# Altium schematic sheet Connectors1.SchDoc: Connectors
size Letter; DrawnBy: Kyle Hong, Noah Chapman; Organization: UW Robotics; Address1: 200 University Avenue; Address2: Waterloo; Address3: Ontario; Address4: Canada N2L 3G6
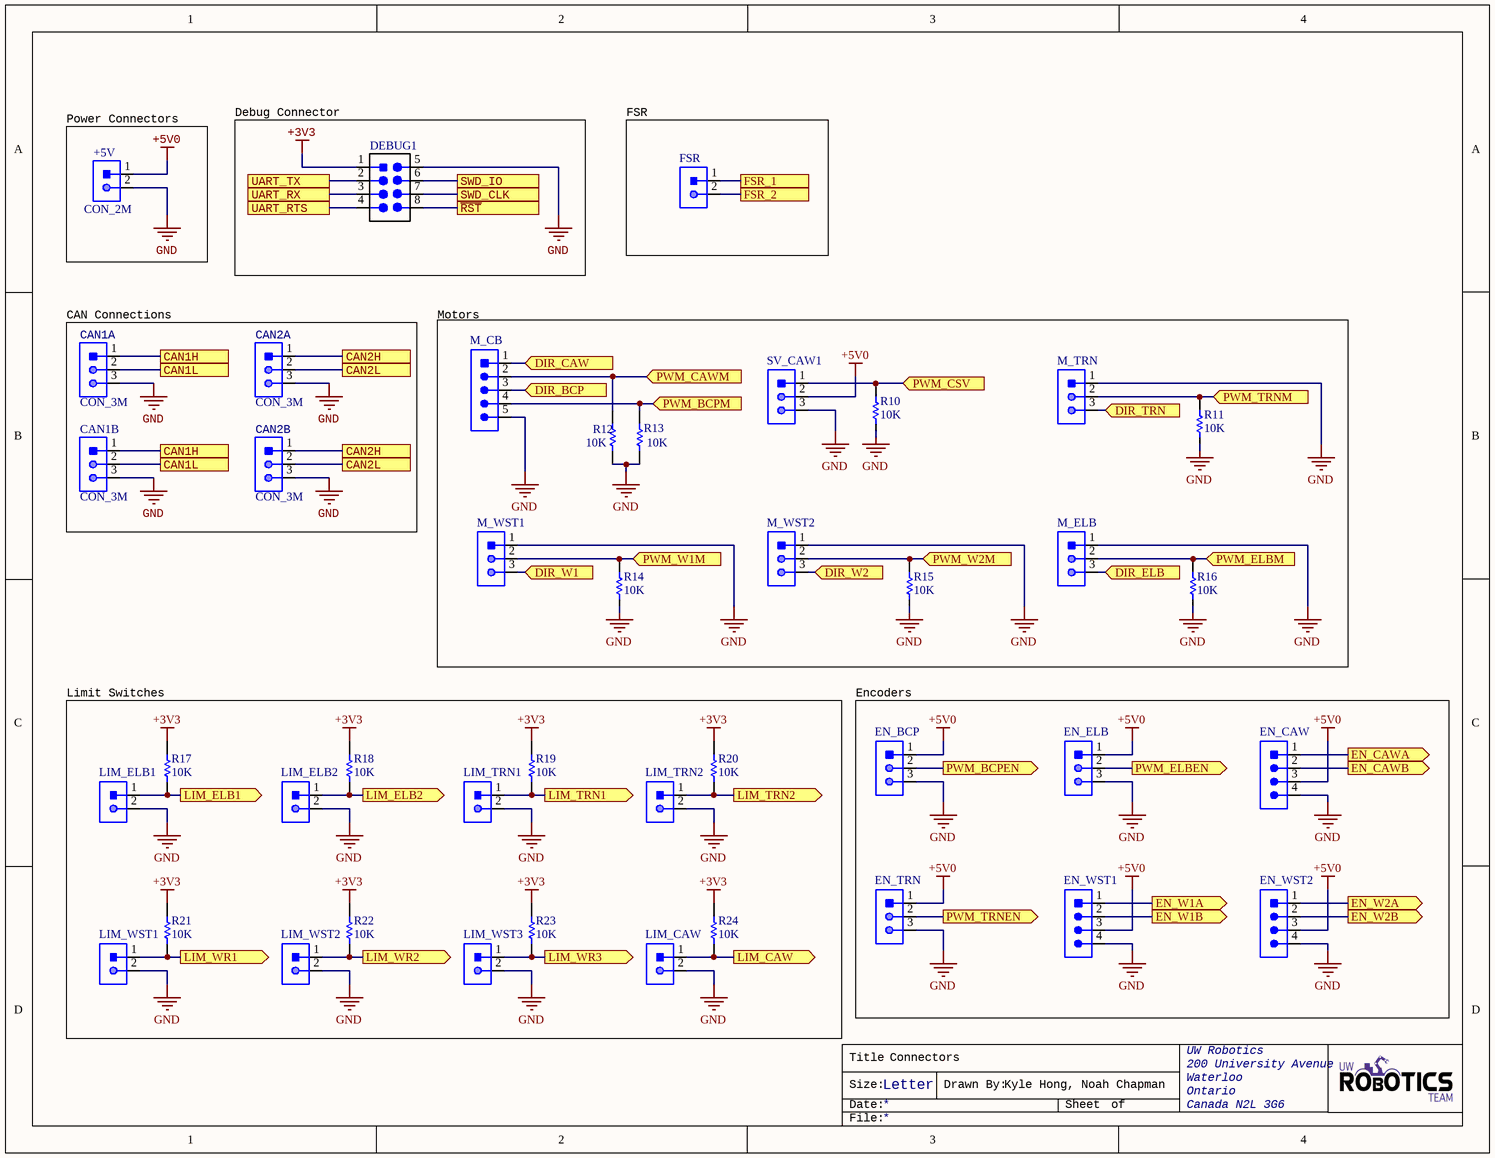
[diagram p0: Connectors1.SchDoc]

## Parts
+5V  CON_2M  [JST-B2B-PHSK]
CAN1A  CON_3M  [JST-B3B-SM4-TB]
CAN1B  CON_3M  [JST-B3B-SM4-TB]
CAN2A  CON_3M  [JST-B3B-SM4-TB]
CAN2B  CON_3M  [JST-B3B-SM4-TB]
DEBUG1  HEADER 4X2  [HEADER_2X4]  (value not drawn)
EN_BCP  CON_3M  [JST-B3B-SM4-TB]  (value not drawn)
EN_CAW  CON_4M  [JST-B4B-PHSK]  (value not drawn)
EN_ELB  CON_3M  [JST-B3B-SM4-TB]  (value not drawn)
EN_TRN  CON_3M  [JST-B3B-SM4-TB]  (value not drawn)
EN_WST1  CON_4M  [JST-B4B-PHSK]  (value not drawn)
EN_WST2  CON_4M  [JST-B4B-PHSK]  (value not drawn)
FSR  CON_2M  [JST-B2B-PHSK]  (value not drawn)
LIM_CAW  CON_2M  [JST-B2B-PHSK]  (value not drawn)
LIM_ELB1  CON_2M  [JST-B2B-PHSK]  (value not drawn)
LIM_ELB2  CON_2M  [JST-B2B-PHSK]  (value not drawn)
LIM_TRN1  CON_2M  [JST-B2B-PHSK]  (value not drawn)
LIM_TRN2  CON_2M  [JST-B2B-PHSK]  (value not drawn)
LIM_WST1  CON_2M  [JST-B2B-PHSK]  (value not drawn)
LIM_WST2  CON_2M  [JST-B2B-PHSK]  (value not drawn)
LIM_WST3  CON_2M  [JST-B2B-PHSK]  (value not drawn)
M_CB  CON_5M  [JST-B5B-PHSK]  (value not drawn)
M_ELB  CON_3M  [JST-B3B-SM4-TB]  (value not drawn)
M_TRN  CON_3M  [JST-B3B-SM4-TB]  (value not drawn)
M_WST1  CON_3M  [JST-B3B-SM4-TB]  (value not drawn)
M_WST2  CON_3M  [JST-B3B-SM4-TB]  (value not drawn)
R10  value 10K  [RESC0603(1608)_N]  (hidden comment: RES_10K_0603)
R11  value 10K  [RESC0603(1608)_N]  (hidden comment: RES_10K_0603)
R12  value 10K  [RESC0603(1608)_N]  (hidden comment: RES_10K_0603)
R13  value 10K  [RESC0603(1608)_N]  (hidden comment: RES_10K_0603)
R14  value 10K  [RESC0603(1608)_N]  (hidden comment: RES_10K_0603)
R15  value 10K  [RESC0603(1608)_N]  (hidden comment: RES_10K_0603)
R16  value 10K  [RESC0603(1608)_N]  (hidden comment: RES_10K_0603)
R17  value 10K  [RESC0603(1608)_N]  (hidden comment: RES_10K_0603)
R18  value 10K  [RESC0603(1608)_N]  (hidden comment: RES_10K_0603)
R19  value 10K  [RESC0603(1608)_N]  (hidden comment: RES_10K_0603)
R20  value 10K  [RESC0603(1608)_N]  (hidden comment: RES_10K_0603)
R21  value 10K  [RESC0603(1608)_N]  (hidden comment: RES_10K_0603)
R22  value 10K  [RESC0603(1608)_N]  (hidden comment: RES_10K_0603)
R23  value 10K  [RESC0603(1608)_N]  (hidden comment: RES_10K_0603)
R24  value 10K  [RESC0603(1608)_N]  (hidden comment: RES_10K_0603)
SV_CAW1  CON_3M  [JST-B3B-SM4-TB]  (value not drawn)

## Blocks framed on the sheet
Power Connectors: +5V
Debug Connector: DEBUG1
FSR: FSR
CAN Connections: CAN1A CAN1B CAN2A CAN2B
Motors: M_CB M_ELB M_TRN M_WST1 M_WST2 R10-R16 SV_CAW1
Limit Switches: LIM_CAW LIM_ELB1 LIM_ELB2 LIM_TRN1 LIM_TRN2 LIM_WST1-LIM_WST3 R17-R24
Encoders: EN_BCP EN_CAW EN_ELB EN_TRN EN_WST1 EN_WST2

## Ports
CAN1H, CAN1L, CAN2H, CAN2L, DIR_BCP (in), DIR_CAW (in), DIR_ELB (in), DIR_TRN (in), DIR_W1 (in), DIR_W2 (in), EN_CAWA (out), EN_CAWB (out), EN_W1A (out), EN_W1B (out), EN_W2A (out), EN_W2B (out), FSR_1, FSR_2, LIM_CAW (out), LIM_ELB1 (out), LIM_ELB2 (out), LIM_TRN1 (out), LIM_TRN2 (out), LIM_WR1 (out), LIM_WR2 (out), LIM_WR3 (out), PWM_BCPEN (out), PWM_BCPM (in), PWM_CAWM (in), PWM_CSV (in), PWM_ELBEN (out), PWM_ELBM (in), PWM_TRNEN (out), PWM_TRNM (in), PWM_W1M (in), PWM_W2M (in), SWD_CLK, SWD_IO, UART_RTS, UART_RX, UART_TX, ~{RST}

## Nets
+3V3: DEBUG1.1(VCC) R17.2 R18.2 R19.2 R20.2 R21.2 R22.2 R23.2 R24.2
+5V0: +5V.1 EN_BCP.1 EN_CAW.3 EN_ELB.1 EN_TRN.1 EN_WST1.3 EN_WST2.3 SV_CAW1.2
GND: +5V.2 CAN1A.3 CAN1B.3 CAN2A.3 CAN2B.3 DEBUG1.5(GND) EN_BCP.3 EN_CAW.4 EN_ELB.3 EN_TRN.3 EN_WST1.4 EN_WST2.4 LIM_CAW.2 LIM_ELB1.2 LIM_ELB2.2 LIM_TRN1.2 LIM_TRN2.2 LIM_WST1.2 LIM_WST2.2 LIM_WST3.2 M_CB.5 M_ELB.1 M_TRN.1 M_WST1.1 M_WST2.1 R10.1 R11.1 R12.1 R13.1 R14.1 R15.1 R16.1 SV_CAW1.3
~{RST}: DEBUG1.8 ; port ~{RST}
CAN1H: CAN1A.1 CAN1B.1 ; port CAN1H
CAN1L: CAN1A.2 CAN1B.2 ; port CAN1L
CAN2H: CAN2A.1 CAN2B.1 ; port CAN2H
CAN2L: CAN2A.2 CAN2B.2 ; port CAN2L
DIR_BCP: M_CB.3 ; port DIR_BCP
DIR_CAW: M_CB.1 ; port DIR_CAW
DIR_ELB: M_ELB.3 ; port DIR_ELB
DIR_TRN: M_TRN.3 ; port DIR_TRN
DIR_W1: M_WST1.3 ; port DIR_W1
DIR_W2: M_WST2.3 ; port DIR_W2
EN_CAWA: EN_CAW.1 ; port EN_CAWA
EN_CAWB: EN_CAW.2 ; port EN_CAWB
EN_W1A: EN_WST1.1 ; port EN_W1A
EN_W1B: EN_WST1.2 ; port EN_W1B
EN_W2A: EN_WST2.1 ; port EN_W2A
EN_W2B: EN_WST2.2 ; port EN_W2B
FSR_1: FSR.1 ; port FSR_1
FSR_2: FSR.2 ; port FSR_2
LIM_CAW: LIM_CAW.1 R24.1 ; port LIM_CAW
LIM_ELB1: LIM_ELB1.1 R17.1 ; port LIM_ELB1
LIM_ELB2: LIM_ELB2.1 R18.1 ; port LIM_ELB2
LIM_TRN1: LIM_TRN1.1 R19.1 ; port LIM_TRN1
LIM_TRN2: LIM_TRN2.1 R20.1 ; port LIM_TRN2
LIM_WR1: LIM_WST1.1 R21.1 ; port LIM_WR1
LIM_WR2: LIM_WST2.1 R22.1 ; port LIM_WR2
LIM_WR3: LIM_WST3.1 R23.1 ; port LIM_WR3
PWM_BCPEN: EN_BCP.2 ; port PWM_BCPEN
PWM_BCPM: M_CB.4 R13.2 ; port PWM_BCPM
PWM_CAWM: M_CB.2 R12.2 ; port PWM_CAWM
PWM_CSV: R10.2 SV_CAW1.1 ; port PWM_CSV
PWM_ELBEN: EN_ELB.2 ; port PWM_ELBEN
PWM_ELBM: M_ELB.2 R16.2 ; port PWM_ELBM
PWM_TRNEN: EN_TRN.2 ; port PWM_TRNEN
PWM_TRNM: M_TRN.2 R11.2 ; port PWM_TRNM
PWM_W1M: M_WST1.2 R14.2 ; port PWM_W1M
PWM_W2M: M_WST2.2 R15.2 ; port PWM_W2M
SWD_CLK: DEBUG1.7 ; port SWD_CLK
SWD_IO: DEBUG1.6 ; port SWD_IO
UART_RTS: DEBUG1.4 ; port UART_RTS
UART_RX: DEBUG1.3 ; port UART_RX
UART_TX: DEBUG1.2 ; port UART_TX

## Notes on the sheet
- Title
- Size:
- Date:
- Letter
- Drawn By:
- Sheet
- of
- File:

## Library data of the parts
DEBUG1 = HEADER 4X2: Header, 4-Pin Dual row; MPN: GRPB042VWVN-RC; Manufacturer: Sullins Connector Solutions; Digikey Part Number: S9015E-04-ND
R10-R24 = RES_10K_0603: RES SMD 10K OHM 5% 1/10W 0603; Manufacturer: Yageo; MPN: RC0603JR-0710KL; Package: 0603 (1608 Metric); Dimensions: 0.063" L x 0.031" W (1.60mm x 0.80mm); Tolerance: 5%; Digikey Part Number: 311-10KGRCT-ND